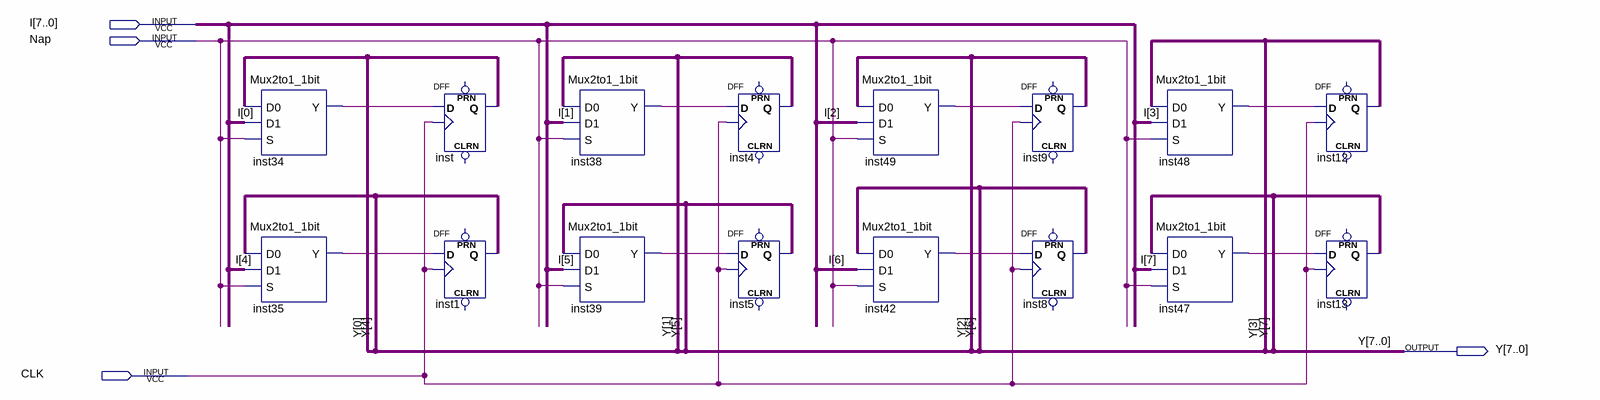
[diagram p0: schematic sheet]
// Quartus schematic Register8bit.bdf as structural Verilog: 16 symbols, 4 pins
module Register8bit (
  input  [7:0] I,
  input  Nap,
  input  CLK,
  output [7:0] Y
);

  wire inst34_y, inst35_y, inst38_y, inst39_y, inst42_y, inst47_y, inst48_y, inst49_y;

  Mux2to1_1bit inst34 (.D0(Y[0]), .D1(I[0]), .S(Nap), .Y(inst34_y));
  Mux2to1_1bit inst35 (.D0(Y[4]), .D1(I[4]), .S(Nap), .Y(inst35_y));
  DFF inst (.CLK(CLK), .D(inst34_y), .Q(Y[0]));  // open: CLRN, PRN
  DFF inst1 (.CLK(CLK), .D(inst35_y), .Q(Y[4]));  // open: CLRN, PRN
  Mux2to1_1bit inst38 (.D0(Y[1]), .D1(I[1]), .S(Nap), .Y(inst38_y));
  Mux2to1_1bit inst39 (.D0(Y[5]), .D1(I[5]), .S(Nap), .Y(inst39_y));
  DFF inst4 (.CLK(CLK), .D(inst38_y), .Q(Y[1]));  // open: CLRN, PRN
  DFF inst5 (.CLK(CLK), .D(inst39_y), .Q(Y[5]));  // open: CLRN, PRN
  Mux2to1_1bit inst49 (.D0(Y[2]), .D1(I[2]), .S(Nap), .Y(inst49_y));
  Mux2to1_1bit inst42 (.D0(Y[6]), .D1(I[6]), .S(Nap), .Y(inst42_y));
  DFF inst9 (.CLK(CLK), .D(inst49_y), .Q(Y[2]));  // open: CLRN, PRN
  DFF inst8 (.CLK(CLK), .D(inst42_y), .Q(Y[6]));  // open: CLRN, PRN
  Mux2to1_1bit inst48 (.D0(Y[3]), .D1(I[3]), .S(Nap), .Y(inst48_y));
  Mux2to1_1bit inst47 (.D0(Y[7]), .D1(I[7]), .S(Nap), .Y(inst47_y));
  DFF inst12 (.CLK(CLK), .D(inst48_y), .Q(Y[3]));  // open: CLRN, PRN
  DFF inst13 (.CLK(CLK), .D(inst47_y), .Q(Y[7]));  // open: CLRN, PRN
endmodule
